# Altium schematic sheet UniBot-PW01 V1.0.SchDoc
size A4
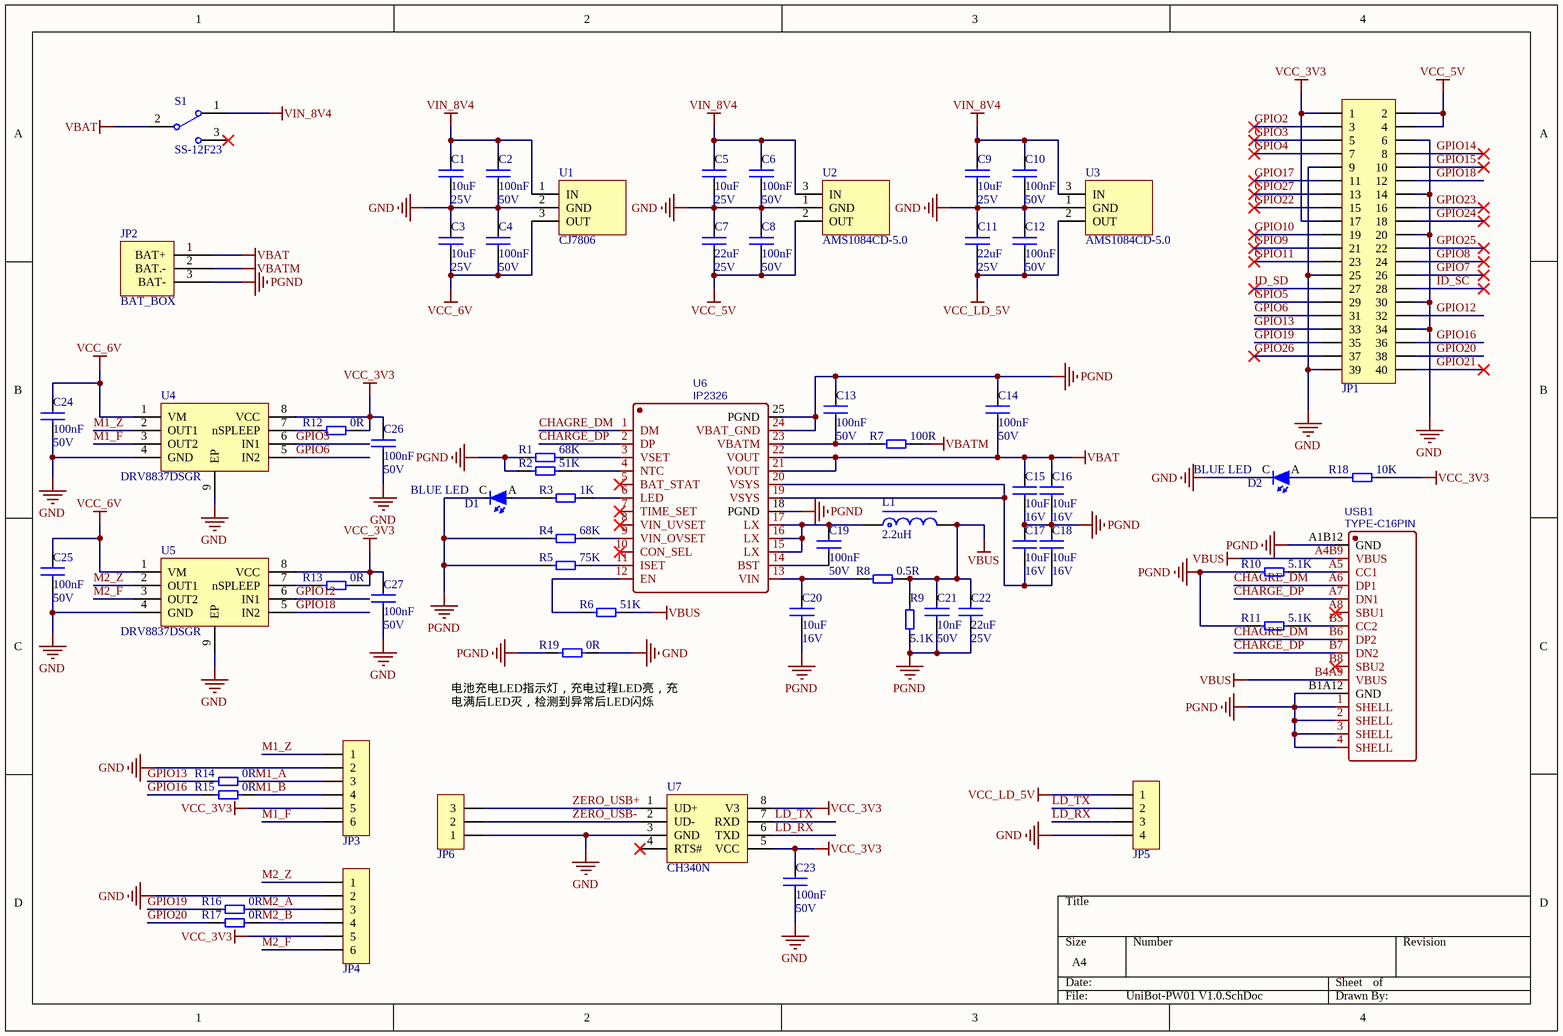
[diagram p0: UniBot-PW01 V1.0.SchDoc]

## Parts
C1  10uF  Voltage: 25V  [C0805]
C2  100nF  Voltage: 50V  [C0402]
C3  10uF  Voltage: 25V  [C0805]
C4  100nF  Voltage: 50V  [C0402]
C5  10uF  Voltage: 25V  [C0805]
C6  100nF  Voltage: 50V  [C0402]
C7  22uF  Voltage: 25V  [C0805]
C8  100nF  Voltage: 50V  [C0402]
C9  10uF  Voltage: 25V  [C0805]
C10  100nF  Voltage: 50V  [C0402]
C11  22uF  Voltage: 25V  [C0805]
C12  100nF  Voltage: 50V  [C0402]
C13  100nF  Voltage: 50V  [C0402]
C14  100nF  Voltage: 50V  [C0402]
C15  10uF  Voltage: 16V  [C0603]
C16  10uF  Voltage: 16V  [C0603]
C17  10uF  Voltage: 16V  [C0603]
C18  10uF  Voltage: 16V  [C0603]
C19  100nF  Voltage: 50V  [C0402]
C20  10uF  Voltage: 16V  [C0603]
C21  10nF  Voltage: 50V  [C0402]
C22  22uF  Voltage: 25V  [C0805]
C23  100nF  Voltage: 50V  [C0402]
C24  100nF  Voltage: 50V  [C0402]
C25  100nF  Voltage: 50V  [C0402]
C26  100nF  Voltage: 50V  [C0402]
C27  100nF  Voltage: 50V  [C0402]
D1  BLUE LED  [LED-0402]
D2  BLUE LED  [LED-0402]
JP1  Header 2X11  [ZERO]  (value not drawn)
JP2  BAT_BOX  [BAT_BOX]
JP3  HDR-1X6  [ZH1.5-WS-6P]  (value not drawn)
JP4  HDR-1X6  [ZH1.5-LS-6P]  (value not drawn)
JP5  HDR-1X4  [ZH1.5-LS-4P]  (value not drawn)
JP6  HDR-1X3  [ZH1.5-WS-3P]  (value not drawn)
L1  2.2uH  [NR5020]
R1  68K  [R0402]
R2  51K  [R0402]
R3  1K  [R0402]
R4  68K  [R0402]
R5  75K  [R0402]
R6  51K  [R0402]
R7  100R  [R1206]
R8  0.5R  [R0603]
R9  5.1K  [R0603]
R10  5.1K  [R0603]
R11  5.1K  [R0603]
R12  0R  [R0402]
R13  0R  [R0402]
R14  0R  [R0402]
R15  0R  [R0402]
R16  0R  [R0402]
R17  0R  [R0402]
R18  10K  [R0402]
R19  0R  [R0805]
S1  SS-12F23  [SS-12F23]
U1  CJ7806  [TO252]
U2  AMS1084CD-5.0  [TO252]
U3  AMS1084CD-5.0  [TO252]
U4  DRV8837DSGR  [DRV8837DSGR]
U5  DRV8837DSGR  [DRV8837DSGR]
U6  IP2326  [QFN24 4x4_L]
U7  CH340N  [SOP8_L]
USB1  TYPE-C16PIN  [U262-16XN-4BVC11]

## Nets
GND: C1.2 C2.2 C3.1 C4.1 C5.2 C6.2 C7.1 C8.1 C9.2 C10.2 C11.1 C12.1 C23.2 C24.2 C25.2 C26.2 C27.2 D2.C JP1.6 JP1.9 JP1.14 JP1.20 JP1.25 JP1.30 JP1.34 JP1.39 JP3.2 JP4.2 JP5.4 JP6.1 R19.2 U1.2(GND) U2.1(GND) U3.1(GND) U4.4(GND) U4.9(EP) U5.4(GND) U5.9(EP) U7.3(GND)
PGND: C13.1 C14.1 C15.2 C16.2 C17.1 C18.1 C20.2 C21.2 C22.2 D1.C JP2.3(BAT-) R1.1 R2.1 R4.1 R5.1 R9.2 R10.1 R11.1 R19.1 U6.18(PGND) U6.24(VBAT_GND) U6.25(PGND) USB1.1(SHELL) USB1.2(SHELL) USB1.3(SHELL) USB1.4(SHELL) USB1.A1B12(GND) USB1.B1A12(GND)
VBAT: C14.2 C15.1 C16.1 JP2.1(BAT+) S1.2 U6.21(VOUT) U6.22(VOUT)
VBATM: JP2.2(BAT.-) R7.2
VBUS: C21.1 C22.1 L1.2 R6.2 R8.2 R9.1 USB1.A4B9(VBUS) USB1.B4A9(VBUS)
VCC_3V3: C23.1 C26.1 C27.1 JP1.1 JP1.17 JP3.5 JP4.5 R12.2 R13.2 R18.2 U4.8(VCC) U5.8(VCC) U7.5(VCC) U7.8(V3)
VCC_5V: C7.2 C8.2 JP1.2 JP1.4 U2.2(OUT)
VCC_6V: C3.2 C4.2 C24.1 C25.1 U1.3(OUT) U4.1(VM) U5.1(VM)
VCC_LD_5V: C11.2 C12.2 JP5.1 U3.2(OUT)
VIN_8V4: C1.1 C2.1 C5.1 C6.1 C9.1 C10.1 S1.1 U1.1(IN) U2.3(IN) U3.3(IN)
CHAGRE_DM: U6.1(DM) USB1.A6(DP1) USB1.B6(DP2)
CHARGE_DP: U6.2(DP) USB1.A7(DN1) USB1.B7(DN2)
GPIO2: JP1.3
GPIO3: JP1.5
GPIO4: JP1.7
GPIO5: JP1.29 U4.6(IN1)
GPIO6: JP1.31 U4.5(IN2)
GPIO7: JP1.26
GPIO8: JP1.24
GPIO9: JP1.21
GPIO10: JP1.19
GPIO11: JP1.23
GPIO12: JP1.32 U5.6(IN1)
GPIO13: JP1.33 R14.1
GPIO14: JP1.8
GPIO15: JP1.10
GPIO16: JP1.36 R15.1
GPIO17: JP1.11
GPIO18: JP1.12 U5.5(IN2)
GPIO19: JP1.35 R16.1
GPIO20: JP1.38 R17.1
GPIO21: JP1.40
GPIO22: JP1.15
GPIO23: JP1.16
GPIO24: JP1.18
GPIO25: JP1.22
GPIO26: JP1.37
GPIO27: JP1.13
ID_SC: JP1.28
ID_SD: JP1.27
LD_RX: JP5.3 U7.6(TXD)
LD_TX: JP5.2 U7.7(RXD)
M1_A: JP3.3 R14.2
M1_B: JP3.4 R15.2
M1_F: JP3.6 U4.3(OUT2)
M1_Z: JP3.1 U4.2(OUT1)
M2_A: JP4.3 R16.2
M2_B: JP4.4 R17.2
M2_F: JP4.6 U5.3(OUT2)
M2_Z: JP4.1 U5.2(OUT1)
ZERO_USB+: JP6.3 U7.1(UD+)
ZERO_USB-: JP6.2 U7.2(UD-)
NetC13_2: C13.2 R7.1 U6.23(VBATM)
NetC17_2: C17.2 C18.2 U6.19(VSYS) U6.20(VSYS)
NetC19_1: C19.1 L1.1 U6.15(LX) U6.16(LX) U6.17(LX)
NetC19_2: C19.2 U6.14(BST)
NetC20_1: C20.1 R8.1 U6.13(VIN)
NetD1_A: D1.A R3.1
NetD2_A: D2.A R18.1
NetR1_2: R1.2 U6.3(VSET)
NetR2_2: R2.2 U6.4(NTC)
NetR3_2: R3.2 U6.6(LED)
NetR4_2: R4.2 U6.9(VIN_OVSET)
NetR5_2: R5.2 U6.11(ISET)
NetR6_1: R6.1 U6.12(EN)
NetR10_2: R10.2 USB1.A5(CC1)
NetR11_2: R11.2 USB1.B5(CC2)
NetR12_1: R12.1 U4.7(nSPLEEP)
NetR13_1: R13.1 U5.7(nSPLEEP)

Not connected (* = marked no-connect by the designer): S1 3*; U6 5(BAT_STAT)* 7(TIME_SET)* 8(VIN_UVSET)* 10(CON_SEL)*; U7 4(RTS#)*; USB1 A8(SBU1)* B8(SBU2)*

## Notes on the sheet
- (near R19) 电池充电LED指示灯，充电过程LED亮，充电满后LED灭，检测到异常后LED闪烁

## Library data of the parts
C1 C3 C5 C9 = E01C00153: CAP CER 10uF 25V X5R 0805; MPN: 0805X106K250NT; Component: Standard; Tolerance: ±10%; MFG: FH; Part Number: E01C00153; ComponentLink1Description: Datasheet; ComponentLink1URL: https://atta.szlcsc.com/upload/public/pdf/source/20200305/C486355_26A10D38EF8C2A5C37091D0039909270.pdf; Part Type: Ceramic; Value: 10uF; Power: 25V; Updated Time: 2024/6/17; Temperature: -55°C ～ 125°C
C2 C4 C6 C8 C10 C12-C14 C19 C23-C27 = E01C00061: CAP CER 100nF 50V X7R 0402; MPN: 0402B104K500NT; Component: Standard; Tolerance: ±10%; MFG: FH; Part Number: E01C00061; ComponentLink1Description: Datasheet; ComponentLink1URL: https://atta.szlcsc.com/upload/public/pdf/source/20200305/C486355_26A10D38EF8C2A5C37091D0039909337.pdf; Part Type: Ceramic; Value: 100nF; Power: 50V; Updated Time: 2024/5/28; Temperature: -55°C ～ 125°C
C7 C11 C22 = E01C00160: CAP CER 22uF 25V X5R 0805; MPN: CL21A226MAQNNNE; Component: Standard; Tolerance: ±20%; MFG: 三星; Part Number: E01C00160; ComponentLink1Description: Datasheet; ComponentLink1URL: https://atta.szlcsc.com/upload/public/pdf/source/20160218/1457707763339.pdf; Part Type: Ceramic; Value: 22uF; Power: 25V; Updated Time: 2024/7/30; Temperature: -55°C ～ 125°C
C15-C18 C20 = E01C00141: CAP CER 10uF 16V X5R 0603; MPN: 0603X106K160NT; Component: Standard; Tolerance: ±10%; MFG: FH; Part Number: E01C00141; ComponentLink1Description: Datasheet; ComponentLink1URL: https://atta.szlcsc.com/upload/public/pdf/source/20200305/C486355_26A10D38EF8C2A5C37091D0039909417.pdf; Part Type: Ceramic; Value: 10uF; Power: 16V; Updated Time: 2024/5/28; Temperature: -55°C ～ 125°C
C21 = E01C00054: CAP CER 10nF 50V X7R 0402; MPN: 0402B103K500NT; Component: Standard; Tolerance: ±10%; MFG: FH; Part Number: E01C00054; ComponentLink1Description: Datasheet; ComponentLink1URL: https://atta.szlcsc.com/upload/public/pdf/source/20200305/C486355_26A10D38EF8C2A5C37091D0039909330.pdf; Part Type: Ceramic; Value: 10nF; Power: 50V; Updated Time: 2024/5/28; Temperature: -55°C ～ 125°C
D1 D2 = E01D00010: Blue led，20mcd@5mA; MPN: BL-HB337A-AV-TRB; MFG: BrtLed; Component: Standard; Part Number: E01D00010; Part Type: LED; Value: BLUE LED; Distributor: Szlcsc; Price: 0.19; Availability: A; ComponentLink1Description: Datasheet
JP1 = Header 20X2: 20*2P接插件; 版权归属: 源创客; BOM名称: 20*2P接插件; 学习资源: www.ooocke.com
JP3 JP4 = Header 6: 6P接插件; 版权归属: 源创客; BOM名称: 6P接插件; 学习资源: www.ooocke.com
JP5 = Header 4: 4P接插件; 版权归属: 源创客; BOM名称: 4P接插件; 学习资源: www.ooocke.com
JP6 = Header 3: 3P接插件; 版权归属: 源创客; BOM名称: 3P接插件; 学习资源: www.ooocke.com
L1 = L-CD: TMPA0503S-2R2MN-D; BOM名称: 功率电感; 版权归属: 源创客; 学习资源: www.ooocke.com
R1 R4 = E01R00976: KES SMD 68K OHM 1% 1/16W 0402; MPN: RC-02W6802FT; Component: Standard; Power: 62.5mW,1/16W; MFG: FH; Part Number: E01R00976; ComponentLink1Description: Datasheet; ComponentLink1URL: https://atta.szlcsc.com/upload/public/pdf/source/20140616/1457707091974.pdf; Part Type: RES; Value: 68K; Tolerance: ±1%; Temperature: -55°C ～ 155°C; Updated Time: 2024/7/12
R2 R6 = E01R00977: KES SMD 51K OHM 1% 1/16W 0402; MPN: RC-02W5102FT; Component: Standard; Power: 62.5mW,1/16W; MFG: FH; Part Number: E01R00977; ComponentLink1Description: Datasheet; ComponentLink1URL: https://atta.szlcsc.com/upload/public/pdf/source/20190505/C118335_36085569433BA7FFC796E569DBFE3139.pdf; Part Type: RES; Value: 51K; Tolerance: ±1%; Temperature: -55°C ～ 155°C; Updated Time: 2024/7/12
R3 = E01R00193: KES SMD 1K OHM 1% 1/16W 0402; MPN: RC-02W1001FT; Component: Standard; Power: 62.5mW，1/16W; MFG: FH; Part Number: E01R00193; ComponentLink1Description: Datasheet; ComponentLink1URL: https://atta.szlcsc.com/upload/public/pdf/source/20210810/804F937F2E44474796563B62A5505FAF.pdf; Part Type: RES; Value: 1K; Tolerance: ±1%; Temperature: -55°C ～ 155°C; Updated Time: 2024/5/28
R5 = E01R00372: KES SMD 75K OHM 1% 1/16W 0402; MPN: RC-02W7502FT; Component: Standard; Power: 62.5mW，1/16W; MFG: FH; Part Number: E01R00372; ComponentLink1Description: Datasheet; ComponentLink1URL: https://atta.szlcsc.com/upload/public/pdf/source/20210810/804F937F2E44474796563B62A5505FAF.pdf; Part Type: RES; Value: 75K; Tolerance: ±1%; Temperature: -55°C ～ 155°C; Updated Time: 2024/5/28
R7 = E01R00979: RES SMD 100R OHM 1% 1/4W 1206; MPN: 1206W4F1000T5E; Component: Standard; Power: 250mW, 1/4W; MFG: UNI-ROYAL(厚声); Part Number: E01R00979; ComponentLink1Description: Datasheet; ComponentLink1URL: https://atta.szlcsc.com/upload/public/pdf/source/20200306/C422600_1E6D84923E4A46A82E41ADD87F860B5C.pdf; Part Type: RES; Value: 100R; Tolerance: ±1%; Temperature: -55°C ～ 155°C; Updated Time: 2024/7/12
R8 = E01R00980: RES SMD 0.5R OHM 1& 1/10W 0603; MPN: 0603WAF500LT5E; Component: Standard; Power: 100mW, 1/10W; Tolerance: ±1%; MFG: UNI-ROYAL(厚声); Part Number: E01R00980; ComponentLink1Description: Datasheet; ComponentLink1URL: https://atta.szlcsc.com/upload/public/pdf/source/20200306/C422600_1E6D84923E4A46A82E41ADD87F860B5C.pdf; Part Type: RES; Value: 0.5R; Temperature: -55°C ～ 155°C; Updated Time: 2024/7/15
R9-R11 = E01R00981: KES SMD 5.1K OHM 1% 1/10W 0603; MPN: RS-03K5101FT; Component: Standard; Power: 100mW, 1/10W; MFG: FH; Part Number: E01R00981; ComponentLink1Description: Datasheet; ComponentLink1URL: https://atta.szlcsc.com/upload/public/pdf/source/20140616/1457707091974.pdf; Part Type: RES; Value: 5.1K; Tolerance: ±1%; Temperature: -55°C ～ 155°C; Updated Time: 2024/7/15
R12-R17 = E01R00001: RES SMD 0R OHM 1% 1/16W 0402; MPN: RC-02000FT; Component: Standard; Power: 62.5mW，1/16W; MFG: FH; Part Number: E01R00001; ComponentLink1Description: Datasheet; ComponentLink1URL: https://atta.szlcsc.com/upload/public/pdf/source/20210810/804F937F2E44474796563B62A5505FAF.pdf; Part Type: RES; Value: 0R; Tolerance: ±1%; Temperature: -55°C ～ 155°C; Updated Time: 2024/5/28
R18 = E01R00975: KES SMD 10K OHM 0.1% 1/16W 0402; MPN: RT0402BRD0710KL; Component: Standard; Power: 62.5mW,1/16W; MFG: YAGEO; Part Number: E01R00975; ComponentLink1Description: Datasheet; ComponentLink1URL: https://atta.szlcsc.com/upload/public/pdf/source/20181009/C309664_C7CEF5A7F4D0541F96EF5E54D941D229.pdf; Part Type: RES; Value: 10K; Tolerance: ±0.1%; Temperature: -55°C ～ 155°C; Updated Time: 2024/7/3
R19 = E01R00973: RES SMD 0R OHM 1% 1/8W 0805; MPN: RS-05000FT; Component: Standard; Power: 125mW，1/8W; MFG: FH; Part Number: E01R00973; ComponentLink1Description: Datasheet; ComponentLink1URL: https://atta.szlcsc.com/upload/public/pdf/source/20190416/C388574_AF5EE7CF95265921D8572CAE9AC5BCAC.pdf; Part Type: RES; Value: 0R; Tolerance: ±1%; Temperature: -55°C ～ 155°C; Updated Time: 2024/6/17
S1 = SSW-1P: 1路波动开关; BOM名称: 波动开关; 版权归属: 源创客; 学习资源: www.ooocke.com
U2 U3 = CJ7805
U6 = IP2326: Manufacturer: Injoinic; Contributor: JustBlackQ; Supplier Part: IP2326; Manufacturer Part: IP2326; link: http://www.sz-dowell.com/static/upload/ueditor/file/20190528/1559009056187024649.pdf; spicePre: U; spiceSymbolName: IP2326
U7 = CH340N: USB转TTL芯片
USB1 = TYPE-C16PIN: Manufacturer: SHOU HAN; Contributor: LCSC; Supplier: LCSC; Supplier Part: C393939; Manufacturer Part: TYPE-C16PIN; spicePre: U; spiceSymbolName: TYPE-C16PIN